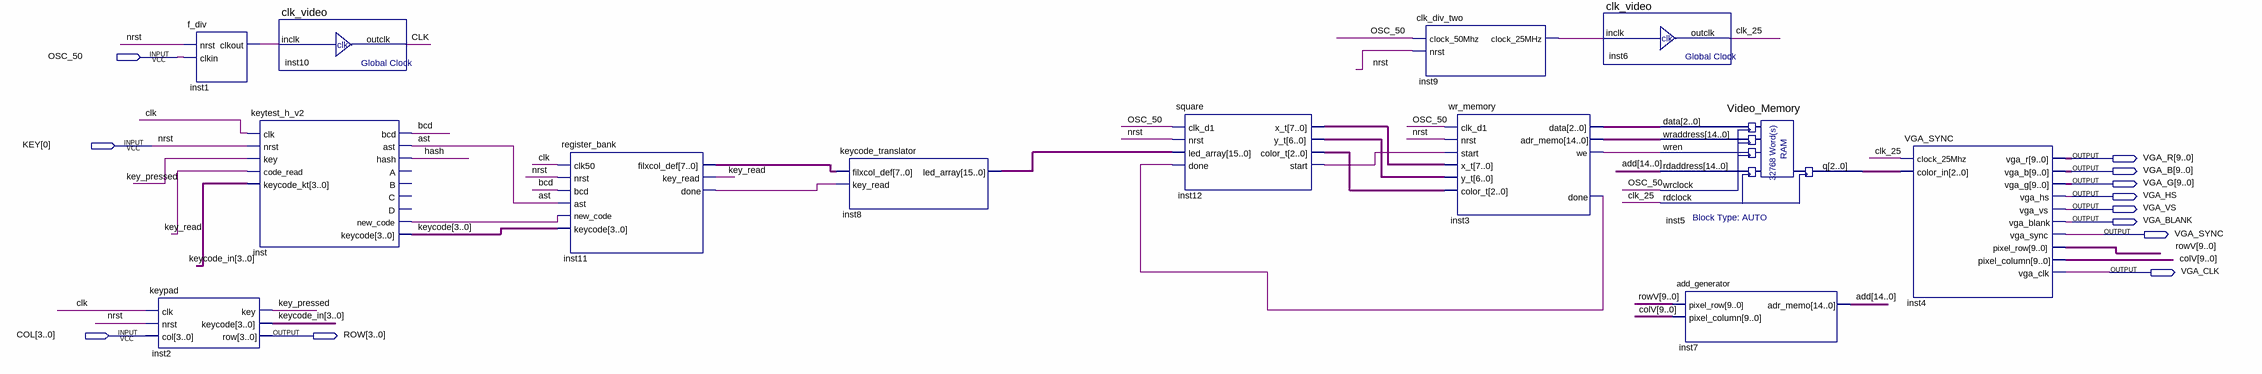
[diagram p0: schematic sheet]
// Quartus schematic P1_BOARD_vga.bdf as structural Verilog: 13 symbols, 12 pins
module P1_BOARD_vga (
  input  OSC_50,
  input  [0:0] KEY,
  input  [3:0] COL,
  output [9:0] VGA_R,
  output [9:0] VGA_B,
  output [9:0] VGA_G,
  output VGA_HS,
  output VGA_VS,
  output VGA_BLANK,
  output VGA_SYNC,
  output VGA_CLK,
  output [3:0] ROW
);

  wire ast, bcd, clk, clk_25, hash, inst1_clkout, inst3_done, inst3_we, inst9_clock_25mhz, inst11_done,
       inst12_start, inst_new_code, key_pressed, key_read;
  wire [2:0] inst3_data, inst5_q, inst12_color_t;
  wire [3:0] keycode, keycode_in;
  wire [6:0] inst12_y_t;
  wire [7:0] inst11_filxcol_def, inst12_x_t;
  wire [9:0] colV, rowV;
  wire [14:0] add, inst3_adr_memo;
  wire [15:0] inst8_led_array;

  f_div inst1 (.nrst(KEY[0]), .clkin(OSC_50), .clkout(inst1_clkout));
  keypad inst2 (.clk(clk), .nrst(KEY[0]), .col(COL), .key(key_pressed), .keycode(keycode_in), .row(ROW));
  clk_video inst10 (.inclk(inst1_clkout), .outclk(clk));
  keytest_h_v2 inst (
    .clk(clk), .nrst(KEY[0]), .key(key_pressed), .code_read(key_read), .keycode_kt(keycode_in), .bcd(bcd),
    .ast(ast), .hash(hash), .new_code(inst_new_code), .keycode(keycode));  // open: A, B, C, D
  register_bank inst11 (
    .clk50(clk), .nrst(KEY[0]), .bcd(bcd), .ast(ast), .new_code(inst_new_code), .keycode(keycode),
    .filxcol_def(inst11_filxcol_def), .key_read(key_read), .done(inst11_done));
  keycode_translator inst8 (.filxcol_def(inst11_filxcol_def), .key_read(inst11_done), .led_array(inst8_led_array));
  square inst12 (
    .clk_d1(OSC_50), .nrst(KEY[0]), .led_array(inst8_led_array), .done(inst3_done), .x_t(inst12_x_t),
    .y_t(inst12_y_t), .color_t(inst12_color_t), .start(inst12_start));
  clk_div_two inst9 (.clock_50Mhz(OSC_50), .nrst(KEY[0]), .clock_25MHz(inst9_clock_25mhz));
  wr_memory inst3 (
    .clk_d1(OSC_50), .start(inst12_start), .nrst(KEY[0]), .x_t(inst12_x_t), .y_t(inst12_y_t),
    .color_t(inst12_color_t), .we(inst3_we), .done(inst3_done), .data(inst3_data), .adr_memo(inst3_adr_memo));
  clk_video inst6 (.inclk(inst9_clock_25mhz), .outclk(clk_25));
  Video_Memory inst5 (
    .data(inst3_data), .wraddress(inst3_adr_memo), .wren(inst3_we), .rdaddress(add), .wrclock(OSC_50),
    .rdclock(clk_25), .q(inst5_q));
  add_generator inst7 (.pixel_row(rowV), .pixel_column(colV), .adr_memo(add));
  VGA_SYNC inst4 (
    .clock_25Mhz(clk_25), .color_in(inst5_q), .vga_r(VGA_R), .vga_b(VGA_B), .vga_g(VGA_G), .vga_hs(VGA_HS),
    .vga_vs(VGA_VS), .vga_blank(VGA_BLANK), .vga_sync(VGA_SYNC), .pixel_row(rowV), .pixel_column(colV),
    .vga_clk(VGA_CLK));

  // Other names for the same wires on the sheet: nrst = KEY[0]
endmodule
